# EAGLE design rgb-svid (EAGLE 7.6.0)
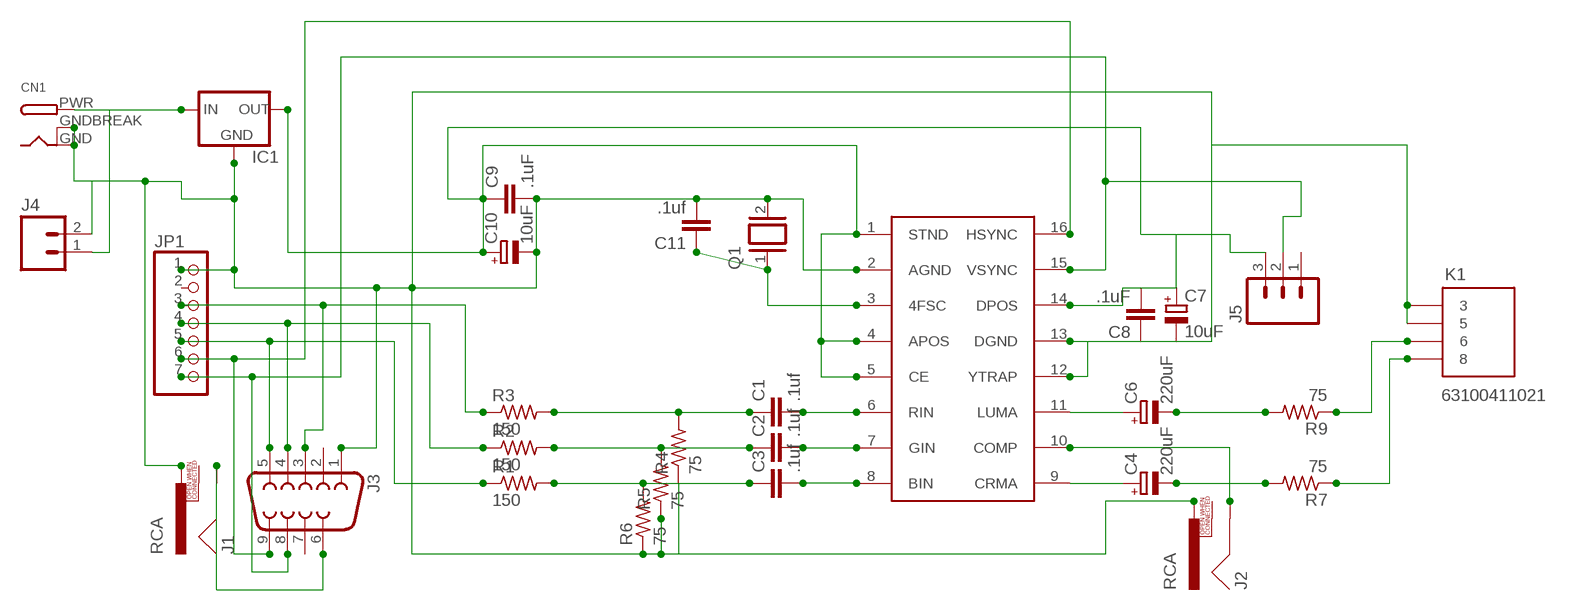
[diagram p0: schematic, sheet 1]

## Parts
C1  .1uf  C2.5/2  [C2.5-2]
C2  .1uf  C2.5/2  [C2.5-2]
C3  .1uf  C2.5/2  [C2.5-2]
C4  220uF  CPOL-EUE2-5  [E2-5]
C6  220uF  CPOL-EUE2-5  [E2-5]
C7  10uF  CPOL-EUE2-5  [E2-5]
C8  .1uF  C2.5/2  [C2.5-2]
C9  .1uF  C2.5/2  [C2.5-2]
C10  10uF  CPOL-EUE2-5  [E2-5]
C11  .1uf  C2.5/2  [C2.5-2]
CN1  DCBARRELPTH  [DCJACK_2MM_PTH]
IC1  78XXL  [78XXL]
J1  RCA  [RCA]
J2  RCA  [RCA]
J3  DB9FEMALE  [DB9]
J4  M02LOCK  [1X02_LOCK]
J5  M03PTH  [1X03]
JP1  PINHD-1X7  [1X07]
K1  63100411021  [63100411021]
Q1  XTAL/S  [QS]
R1  150  R-US_0207/12  [0207/12]
R2  150  R-US_0207/12  [0207/12]
R3  150  R-US_0207/12  [0207/12]
R4  75  R-US_0207/12  [0207/12]
R5  75  R-US_0207/12  [0207/12]
R6  75  R-US_0207/12  [0207/12]
R7  75  R-US_0207/12  [0207/12]
R9  75  R-US_0207/12  [0207/12]
U$1  AD725  [SO16W]

## Nets
AUDIO_OUT: J1.SHELL J3.6
C_VID_OUT: J2.SHELL U$1.10(COMP)
GND: C7.- C8.1 C9.2 C10.- C11.2 CN1.GND CN1.GNDBREAK IC1.GND J1.PIN J2.PIN J3.1 J4.2 JP1.1 K1.3 K1.5 Q1.2 R4.1 R5.1 R6.1 U$1.2(AGND) U$1.12(YTRAP) U$1.13(DGND)
N$1: C1.1 R3.2 R4.2
N$2: C2.1 R2.2 R5.2
N$3: C7.+ C8.2 C9.1 C10.+ IC1.OUT J5.3 U$1.1(STND) U$1.4(APOS) U$1.5(CE) U$1.14(DPOS)
N$4: C3.1 R1.2 R6.2
N$5: C4.- R7.2
N$6: J3.9 JP1.6 U$1.16(HSYNC)
N$7: C6.- R9.2
N$8: C4.+ U$1.9(CRMA)
N$9: K1.6 R9.1
N$11: CN1.PWR IC1.IN J4.1
N$12: K1.8 R7.1
N$13: C11.1 Q1.1 U$1.3(4FSC)
N$14: C6.+ U$1.11(LUMA)
N$15: J3.4 JP1.4 R2.1
N$16: J3.5 JP1.5 R1.1
N$19: J3.8 J5.2 JP1.7 U$1.15(VSYNC)
N$20: C3.2 U$1.8(BIN)
N$21: C2.2 U$1.7(GIN)
N$22: C1.2 U$1.6(RIN)
N$24: J3.3 JP1.3 R3.1
Unconnected: J1.SWITCH J2.SWITCH J3.2 J3.7 J5.1 JP1.2

## Library data of the parts
C1-C3 C8 C9 C11 = capacitor-wima:C: CAPACITOR naming: grid - package width
C4 C6 C7 C10 = rcl:CPOL-EU: POLARIZED CAPACITOR, European symbol
CN1 = adafruit:DCBARREL: 2.0mm DC Barrel Jack DCJACK_2MM_PTH - Through Hole Jack (4UConnector: 05537)
IC1 = v-reg:78XXL: VOLTAGE REGULATOR
J1 J2 = SparkFun-Connectors:RCA
J3 = SparkFun-Connectors:DB9: DB9 Connector Standard DB9 (D-Sub 9) serial connector. Can be used for CAN bus as well as RS485 and RS232. Footprint production proven. Spark Fun Electronics SKU : PRT-00429; PROD_ID: CONN-08194
J4 = SparkFun-Connectors:M02: Standard 2-pin 0.1" header. Use with - straight break away headers ( PRT-00116) - right angle break away headers (PRT-00553) - swiss pins (PRT-00743) - machine pins (PRT-00117) - female headers (PRT-00115) Molex polarized connector foot print use with: PRT-08233 with associated crimp pins and housings. 2.54_SCREWTERM for use with PRT-10571. 3.5mm Screw Terminal footprints for PRT-08084 5mm Screw Terminal footprints for use with PRT-08432
J5 = SparkFun-Connectors:M03: Header 3 Standard 3-pin 0.1" header. Use with straight break away headers (SKU : PRT-00116), right angle break away headers (PRT-00553), swiss pins (PRT-00743), machine pins (PRT-00117), and female headers (PRT-00115). Molex polarized connector foot print use with SKU : PRT-08232 with associated crimp pins and housings.
JP1 = pinhead:PINHD-1X7: PIN HEADER
K1 = Wuerth_Elektronik_eiCan_Communication_Connectors_v2.2:63100411021: WR-COM Horizontal Half Shielded Mini DIN, 4 pins
Q1 = special:XTAL/S: CRYSTAL
R1-R7 R9 = resistor:R-US_: RESISTOR, American symbol
U$1 = ad725:AD725

## Board
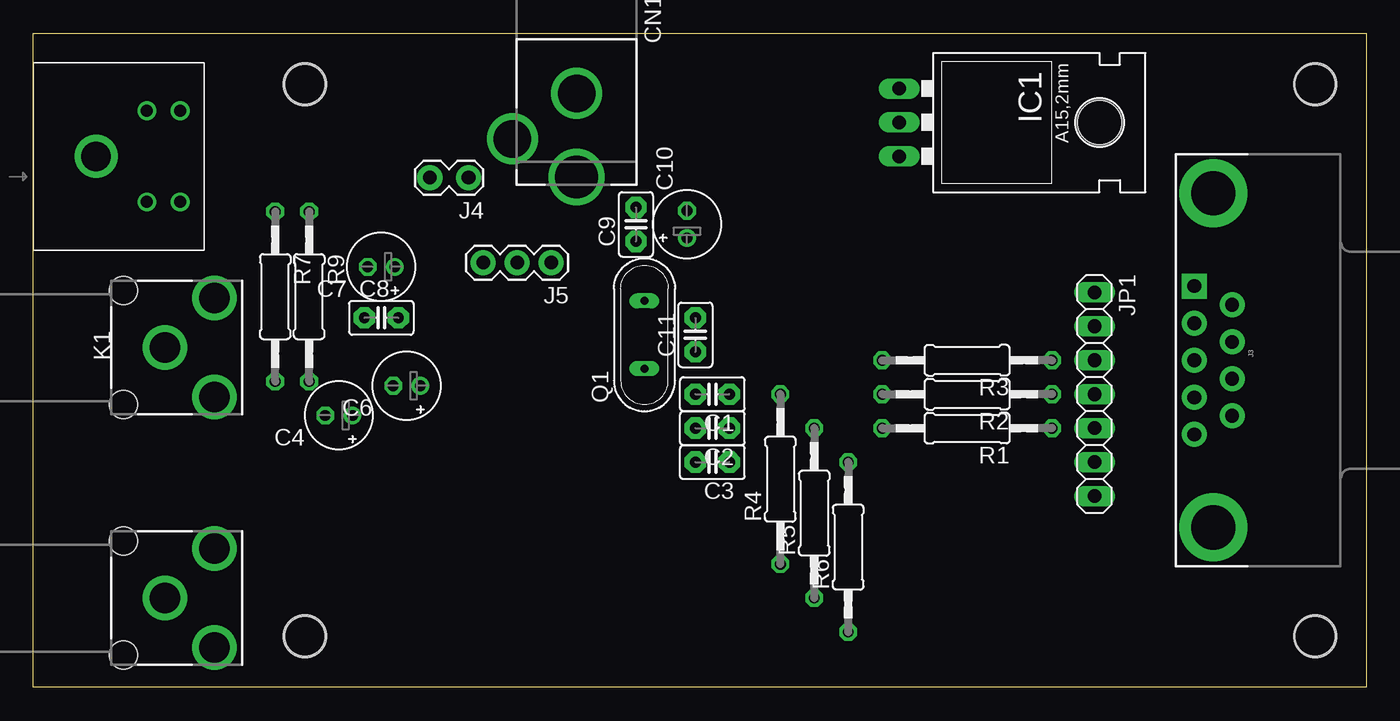
[diagram p1: board, top side]
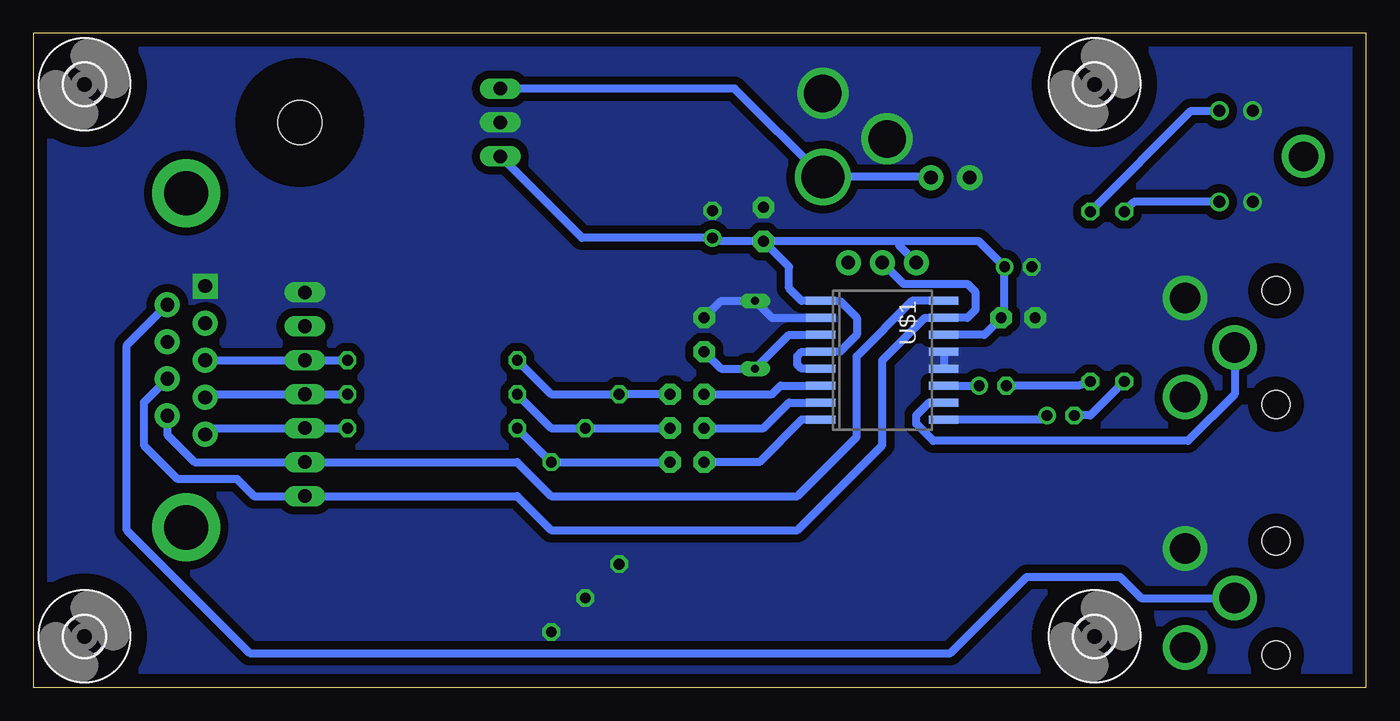
[diagram p2: board, bottom side, seen from below]

Size 99.68 x 48.88 mm. Coordinates in mm from the lower left corner, seen from the top.
Outline: 99.68,0 0,0 0,48.88 99.68,48.88 99.68,0
Copper layers 16: Bottom 0.035mm
Design rules "default *": minimum track width 10mil, minimum drill 24mil, track to track 8mil, track to pad 8mil, pad to pad 8mil, via to via 8mil, smd to smd 8mil, copper to edge 40mil, drill to drill 8mil, minimum pad ring 10mil, minimum via ring 8mil, stop-mask expansion 4mil, vias tented up to drill 0mil, thermal gap 10mil
Holes 3.2 mm at 95.87,3.81 95.87,45.09 20.31,45.09 20.31,3.81

### Footprints (pad centres in the part's own frame; a part is rotated, then mirrored left to right if it is on the bottom)
C2.5-2 = drill 0.813 pad 1.6 octagon: 1 -1.27,0; 2 1.27,0
E2-5 = drill 0.813 pad 1.27: + -1.016,0 | drill 0.813 pad 1.27 octagon: - 1.016,0
DCJACK_2MM_PTH = drill 2.8: GND 0,7.35; GNDBREAK 4.8,10.75 | drill 3.2: PWR 0,13.6
78XXL = drill 1.016 long: GND 0,-3.81; IN -2.54,-3.81; OUT 2.54,-3.81 | hole 3.302: 0,11.176
RCA = drill 2.3: PIN 3.7,3.7; SHELL 0,0; SWITCH 3.7,-3.7 | hole 2.1: -3.1,4.25; -3.1,-4.25
DB9 = drill 1.016 pad 1.88 square: 1 -5.54,-1.42 | drill 1.016 pad 1.88: 2 -2.77,-1.42; 3 0,-1.42; 4 2.77,-1.42; 5 5.54,-1.42; 6 -4.15,1.42; 7 -1.38,1.42; 8 1.38,1.42; 9 4.15,1.42 | drill 3.302 pad 5.08: G1 -12.5,0; G2 12.5,0
1X02_LOCK = drill 1.016 pad 1.88: 1 -0.178,0; 2 2.718,0
1X03 = drill 1.016 pad 1.88: 1 0,0; 2 2.54,0; 3 5.08,0
1X07 = drill 1.016 long: 1 -7.62,0; 2 -5.08,0; 3 -2.54,0; 4 0,0; 5 2.54,0; 6 5.08,0; 7 7.62,0
63100411021 = drill 0.9: 3 3.405,-8.5; 5 -3.405,-8.5; 6 3.405,-11; 8 -3.405,-11 | drill 2.2: Z1 0,-4.7
QS = drill 0.61 long: 1 -2.54,0; 2 2.54,0
0207/12 = drill 0.813 octagon: 1 -6.35,0; 2 6.35,0
SO16W = smd 0.6 x 2.2: 1 -4.445,-4.6; 2 -3.175,-4.6; 3 -1.905,-4.6; 4 -0.635,-4.6; 5 0.635,-4.6; 6 1.905,-4.6; 7 3.175,-4.6; 8 4.445,-4.6; 9 4.445,4.6; 10 3.175,4.6; 11 1.905,4.6; 12 0.635,4.6; 13 -0.635,4.6; 14 -1.905,4.6; 15 -3.175,4.6; 16 -4.445,4.6
3,0 = hole 3: 0,0

### Placement (x,y rotation side)
C1  50.79,21.91 180 top
C2  50.79,19.37 180 top
C3  50.79,16.83 180 top
C4  22.85,20.32 180 top
C6  27.93,22.54 180 top
C7  26.02,31.43 180 top
C8  26.02,27.62 0 top
C9  45.07,34.61 90 top
C10  48.88,34.61 90 top
C11  49.52,26.35 90 top
CN1  40.63,51.75 180 top
IC1  68.57,42.23 270 top
J1  9.83,6.67 0 top
J2  9.83,25.4 0 top
J3  88.25,24.45 270 top
J4  32.37,38.1 180 top
J5  38.72,31.75 180 top
JP1  79.36,21.91 270 top
K1  -0.01,39.69 90 top
Q1  45.71,26.35 90 top
R1  69.84,19.37 180 top
R2  69.84,21.91 180 top
R3  69.84,24.45 180 top
R4  55.87,15.56 90 top
R5  58.41,13.02 90 top
R6  60.95,10.48 90 top
R7  18.09,29.21 270 top
R9  20.62,29.21 270 top
U$1  36.18,24.45 270 bottom
U$2  [3,0]  95.87,45.09 0 bottom
U$3  [3,0]  95.87,3.81 0 bottom
U$4  [3,0]  20.31,45.09 0 bottom
U$5  [3,0]  20.31,3.81 0 bottom

### Tracks (layer width: path | path; a pad name or v marks a point on that pad's centre or on a via)
AUDIO_OUT
  Bottom 0.61: J3.6 92.7,25.57 92.7,11.75 83.49,2.54 31.1,2.54 25.39,8.26 18.4,8.26 16.82,6.67 J1.SHELL
C_VID_OUT
  Bottom 0.61: U$1.10 32.69,21.27 33.64,20.32 33.64,19.68 32.37,18.41 13.32,18.41 9.83,21.91 J2.SHELL
GND
  Bottom 0.61: U$1.13 U$1.12 | U$1.2 44.44,27.62 Q1.2 48.25,28.89 C11.2
  pour Bottom (isolate 0.61, no thermals): 0.62,0.32 99.05,0.32 99.05,48.58 0.62,48.58
N$1
  Bottom 0.61: C1.1 R4.2 60.95,21.91 R3.2
N$2
  Bottom 0.61: C2.1 R5.2 60.95,19.37 R2.2
N$3
  Bottom 0.61: C9.1 48.63,33.34 C10.+ 58.66,33.59 IC1.OUT | U$1.5 42.21,23.81 42.53,24.13 42.53,24.77 42.21,25.08 U$1.4 39.36,25.08 38.09,26.35 38.09,27.62 39.36,28.89 U$1.1 42.21,28.89 43.17,29.84 43.17,31.43 C9.1 | U$1.14 28.56,26.35 C8.2 27.04,27.88 C7.+ 28.94,33.34 34.91,33.34 | 34.91,33.34 C9.1 | J5.3 34.91,33.02 34.91,33.34
N$4
  Bottom 0.61: C3.1 R6.2 R1.2
N$5
  Bottom 0.61: R7.2 20.62,20.32 C4.-
N$6
  Bottom 0.61: J3.9 89.67,18.88 87.62,16.83 JP1.6 63.49,16.83 60.95,14.29 42.53,14.29 38.09,18.73 38.09,24.77 33.96,28.89 U$1.16
N$7
  Bottom 0.61: C6.- 21.58,22.54 R9.2
N$8
  Bottom 0.61: C4.+ 24.18,20 U$1.9
N$9
  Bottom 0.61: R9.1 13.09,43.09 K1.6
N$11
  Bottom 0.61: IC1.IN 47.24,44.77 CN1.PWR 32.6,38.15 J4.1
N$12
  Bottom 0.61: R7.1 17.36,36.28 K1.8
N$13
  Bottom 0.61: C11.1 48.25,23.81 Q1.1 43.17,26.35 U$1.3
N$14
  Bottom 0.61: U$1.11 C6.+
N$15
  Bottom 0.61: J3.4 86.6,21.91 JP1.4 R2.1
N$16
  Bottom 0.61: J3.5 86.37,19.37 JP1.5 R1.1
N$19
  Bottom 0.61: J3.8 89.67,23.03 91.43,21.27 91.43,18.1 88.89,15.56 84.44,15.56 83.17,14.29 JP1.7 63.49,14.29 60.95,11.75 42.53,11.75 36.18,18.1 36.18,24.45 33.01,27.62 U$1.15 29.83,27.62 29.2,28.26 29.2,29.53 29.83,30.16 34.6,30.16 J5.2
N$20
  Bottom 0.61: U$1.8 42.21,20 45.39,16.83 C3.2
N$21
  Bottom 0.61: U$1.7 43.17,21.27 45.07,19.37 C2.2
N$22
  Bottom 0.61: C1.2 44.44,21.91 43.8,22.54 U$1.6
N$24
  Bottom 0.61: J3.3 JP1.3 R3.1